# EAGLE schematic VentaConnected_Arduino_V0.01_2017-11-21_AutoRouting (EAGLE 8.3.2)
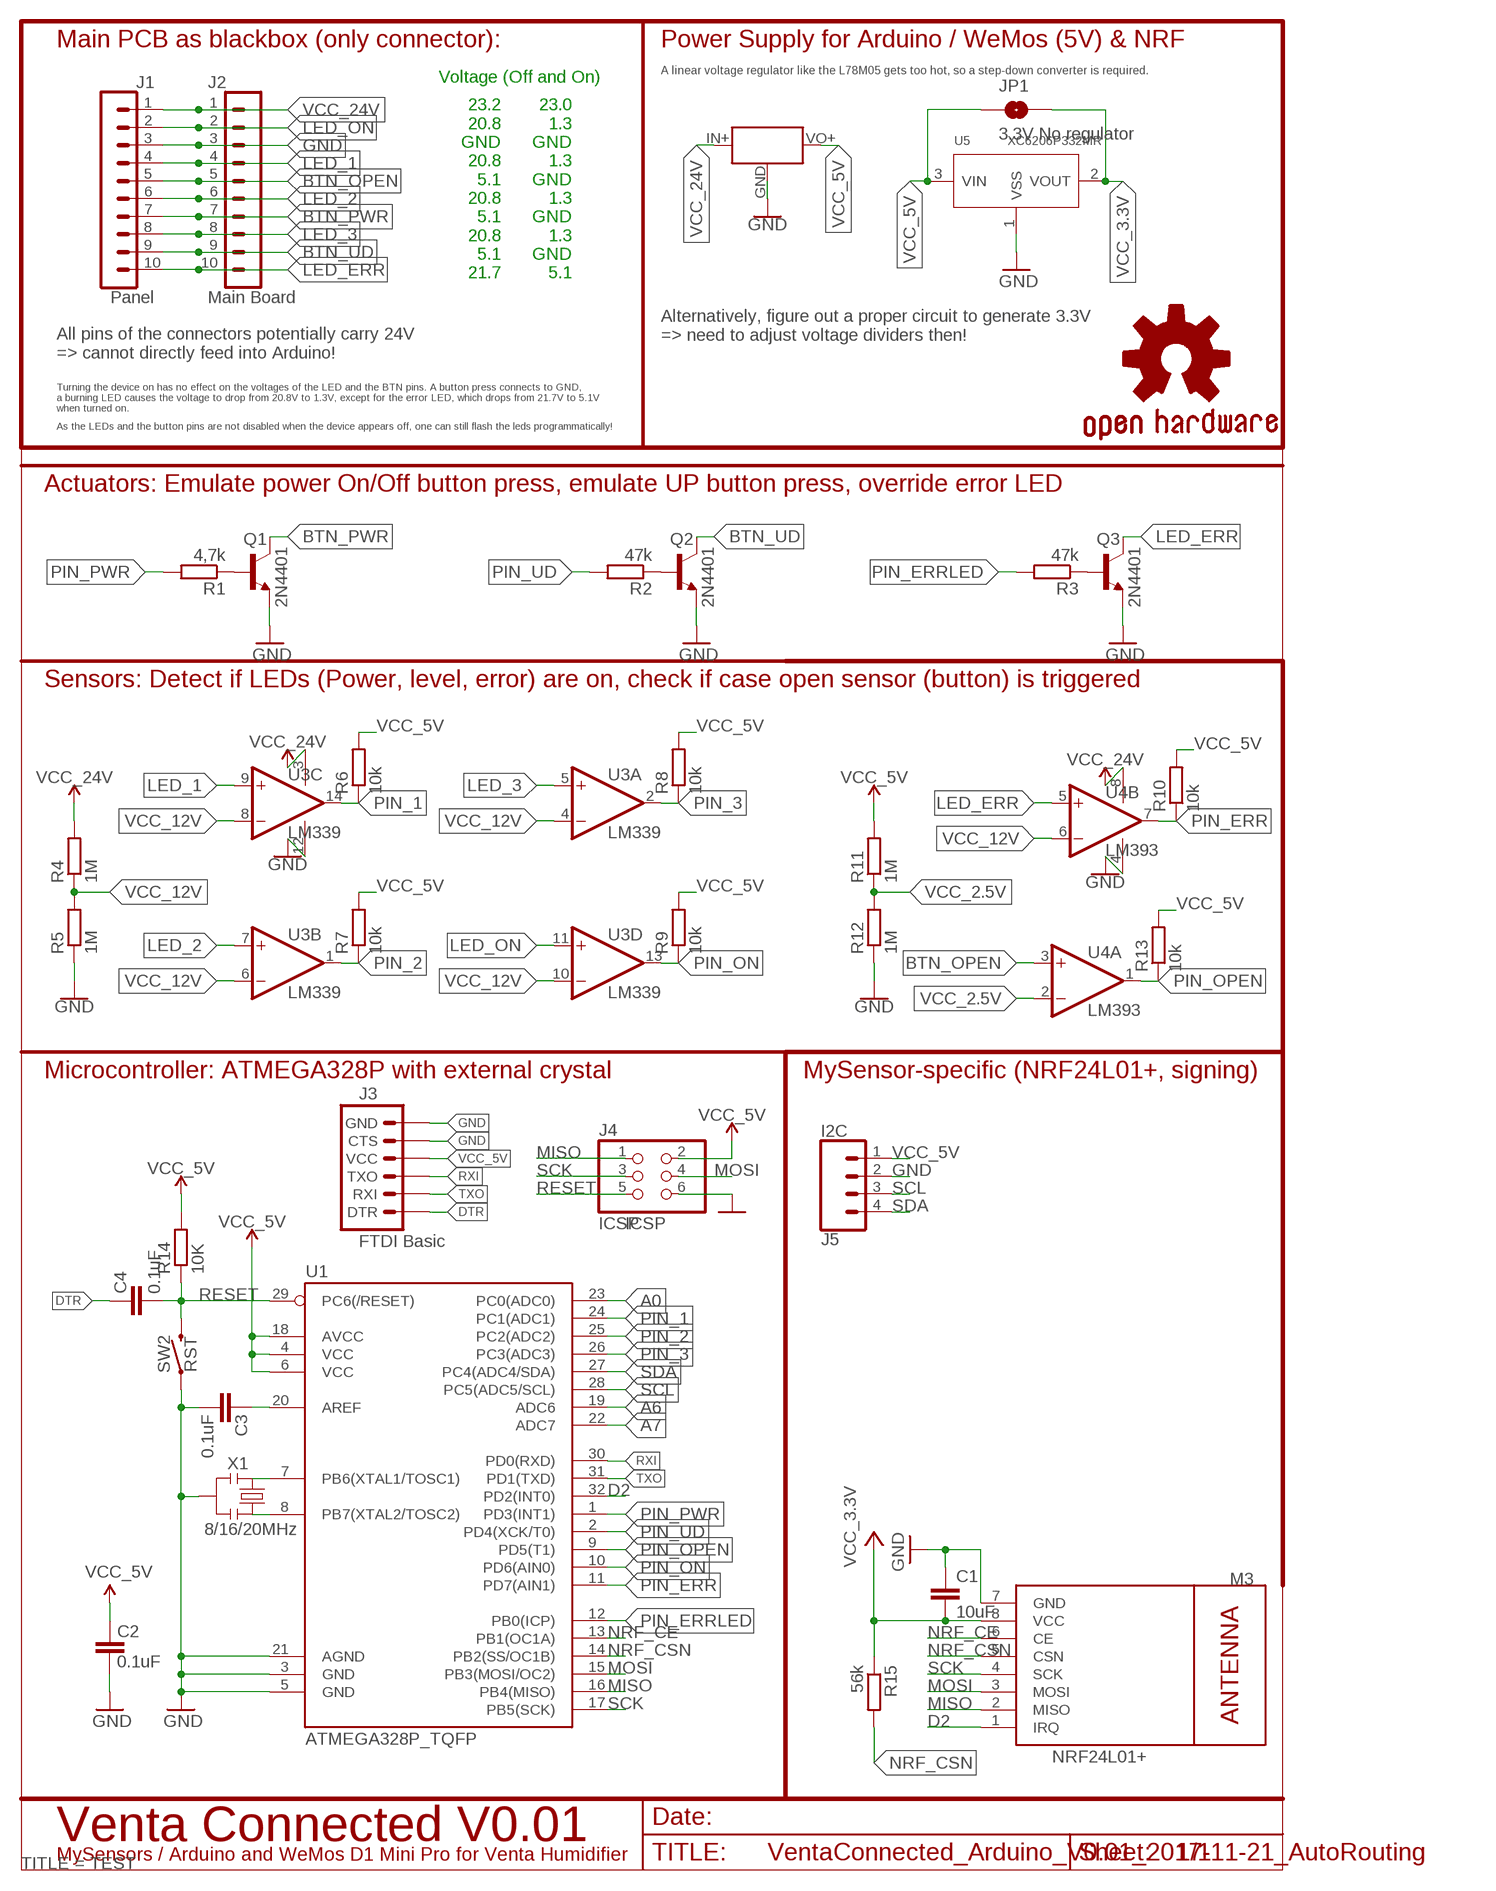
[diagram p0: schematic, sheet 1]
FRAME3 (A4-SMALL-DOCFIELD): TITLE: TEST

## Parts
C1  10uF  C-EUC0805  [C0805]
C2  0.1uF  CAP0805  [0805]
C3  0.1uF  CAP0805  [0805]
C4  0.1uF  CAP0805  [0805]
GOLD_ORB_SM1  OSHWLOGO_GOLD_ORB_SM  [OSHW2]
J1  Panel  CONN_05X2SHD  [2X5-SHROUDED]
J2  Main Board  CONN_05X2PTH  [2X5]
J3  FTDI Basic  ARDUINO_SERIAL_PROGRAMPTH  [1X06]
J4  ICSP  PINHD-2X3  [2X03]
J5  I2C  CONN_04  [1X04]
JP1  3.3V No regulator  JUMPER-SMT_2_NO_SILK  [SMT-JUMPER_2_NO_SILK]
M3  NRF24L01+  WIRELESS-NRF24L01SMD  [WIRELESS-NRF24L01-SMD]
Q1  2N4401  MMBT4401LT1-NPN-SOT23-BEC  [SOT23-BEC]
Q2  2N4401  MMBT4401LT1-NPN-SOT23-BEC  [SOT23-BEC]
Q3  2N4401  MMBT4401LT1-NPN-SOT23-BEC  [SOT23-BEC]
R1  4,7k  R-EU_R0805  [R0805]
R2  47k  R-EU_R0805  [R0805]
R3  47k  R-EU_R0805  [R0805]
R4  1M  R-EU_R0805  [R0805]
R5  1M  R-EU_R0805  [R0805]
R6  10k  R-EU_R0805  [R0805]
R7  10k  R-EU_R0805  [R0805]
R8  10k  R-EU_R0805  [R0805]
R9  10k  R-EU_R0805  [R0805]
R10  10k  R-EU_R0805  [R0805]
R11  1M  R-EU_R0805  [R0805]
R12  1M  R-EU_R0805  [R0805]
R13  10k  R-EU_R0805  [R0805]
R14  10K  R-EU_R0805  [R0805]
R15  56k  R-EU_R0805  [R0805]
SW2  RST  MOMENTARY-SWITCH-SPST-SMD-6.0X3.5MM  [TACTILE_SWITCH_SMD_6.0X3.5MM]
U1  ATMEGA328P_TQFP  [TQFP32-08]
U2  MINI_BUCK_CONVERTER_UPSIDEDOWN  [MINI_BUCK_CONVERTER_UPDOWN]
U3  LM339  TLC339D  [SO14]
U4  LM393  LM393D  [SO08]
U5  XC6206P332MR  PMIC-LDO-XC6206P332MR-G(SOT23)  [SOT-23]
X1  8/16/20MHz  RESONATOR1:1  [RESONATOR-SMD-1:1]

## Nets
A0: U1.23(PC0(ADC0))
A6: U1.19(ADC6)
A7: U1.22(ADC7)
AREF: C3.2 U1.20(AREF)
BTN_OPEN: J1.5 J2.5 U4.3(A:+IN)
BTN_PWR: J1.7 J2.7 Q1.C
BTN_UD: J1.9 J2.9 Q2.C
D2: M3.1(IRQ) U1.32(PD2(INT0))
DTR: C4.2 J3.1(DTR)
GND: C1.1 C2.1 C3.1 J1.3 J2.3 J3.5(CTS) J3.6(GND) J4.6 J5.2 M3.7(GND) Q1.E Q2.E Q3.E R5.1 R12.1 SW2.1 U1.3(GND) U1.5(GND) U1.21(AGND) U2.GND U3.12(P:V-) U4.4(P:V-) U5.1(VSS) X1.2
LED_1: J1.4 J2.4 U3.9(C:+IN)
LED_2: J1.6 J2.6 U3.7(B:+IN)
LED_3: J1.8 J2.8 U3.5(A:+IN)
LED_ERR: J1.10 J2.10 Q3.C U4.5(B:+IN)
LED_ON: J1.2 J2.2 U3.11(D:+IN)
MISO: J4.1 M3.2(MISO) U1.16(PB4(MISO))
MOSI: J4.4 M3.3(MOSI) U1.15(PB3(MOSI/OC2))
N$2: Q1.B R1.1
N$5: Q3.B R3.1
N$6: Q2.B R2.1
N$12: U1.8(PB7(XTAL2/TOSC2)) X1.3
N$13: U1.7(PB6(XTAL1/TOSC1)) X1.1
NRF_CE: M3.6(CE) U1.13(PB1(OC1A))
NRF_CSN: M3.5(CSN) R15.2 U1.14(PB2(SS/OC1B))
PIN_1: R6.1 U1.24(PC1(ADC1)) U3.14(C:OUT)
PIN_2: R7.1 U1.25(PC2(ADC2)) U3.1(B:OUT)
PIN_3: R8.1 U1.26(PC3(ADC3)) U3.2(A:OUT)
PIN_ERR: R10.1 U1.11(PD7(AIN1)) U4.7(B:OUT)
PIN_ERRLED: R3.2 U1.12(PB0(ICP))
PIN_ON: R9.1 U1.10(PD6(AIN0)) U3.13(D:OUT)
PIN_OPEN: R13.1 U1.9(PD5(T1)) U4.1(A:OUT)
PIN_PWR: R1.2 U1.1(PD3(INT1))
PIN_UD: R2.2 U1.2(PD4(XCK/T0))
RESET: C4.1 J4.5 R14.1 SW2.2 U1.29(PC6(/RESET))
RXI: J3.3(TXO) U1.30(PD0(RXD))
SCK: J4.3 M3.4(SCK) U1.17(PB5(SCK))
SCL: J5.3 U1.28(PC5(ADC5/SCL))
SDA: J5.4 U1.27(PC4(ADC4/SDA))
TXO: J3.2(RXI) U1.31(PD1(TXD))
VCC_2.5V: R11.1 R12.2 U4.2(A:-IN)
VCC_3.3V: C1.2 JP1.2 M3.8(VCC) R15.1 U5.2(VOUT)
VCC_5V: C2.2 J3.4(VCC) J4.2 J5.1 JP1.1 R6.2 R7.2 R8.2 R9.2 R10.2 R11.2 R13.2 R14.2 U1.4(VCC) U1.6(VCC) U1.18(AVCC) U2.VO+(VOUT) U5.3(VIN)
VCC_12V: R4.1 R5.2 U3.4(A:-IN) U3.6(B:-IN) U3.8(C:-IN) U3.10(D:-IN) U4.6(B:-IN)
VCC_24V: J1.1 J2.1 R4.2 U2.IN+(VIN) U3.3(P:V+) U4.8(P:V+)

## Notes on the sheet
- Main PCB as blackbox (only connector): | Power Supply for Arduino / WeMos (5V) & NRF
- A linear voltage regulator like the L78M05 gets too hot, so a step-down converter is required.
- Voltage (Off and On)
- 23.2
  20.8
  GND
  20.8
  5.1
  20.8
  5.1
  20.8
  5.1
  21.7
- 23.0
  1.3
  GND
  1.3
  GND
  1.3
  GND
  1.3
  GND
  5.1
- Alternatively, figure out a proper circuit to generate 3.3V 
  => need to adjust voltage dividers then!
- All pins of the connectors potentially carry 24V 
  => cannot directly feed into Arduino!
- Turning the device on has no effect on the voltages of the LED and the BTN pins. A button press connects to GND, 
  a burning LED causes the voltage to drop from 20.8V to 1.3V, except for the error LED, which drops from 21.7V to 5.1V 
  when turned on.
- As the LEDs and the button pins are not disabled when the device appears off, one can still flash the leds programmatically!
- Actuators: Emulate power On/Off button press, emulate UP button press, override error LED
- Sensors: Detect if LEDs (Power, level, error) are on, check if case open sensor (button) is triggered
- Microcontroller: ATMEGA328P with external crystal | MySensor-specific (NRF24L01+, signing)
- ICSP
- Venta Connected V0.01
- MySensors / Arduino and WeMos D1 Mini Pro for Venta Humidifier

## Library data of the parts
C1 = rcl:C-EU: CAPACITOR, European symbol
C2-C4 = SparkFun:CAP: Capacitor Standard 0603 ceramic capacitor, and 0.1" leaded capacitor.
GOLD_ORB_SM1 = bfl:OSHWLOGO: These are Open-Source Hardware logos.
J1 = opentools-connectors:CONN_05X2: Multi connection point. Often used as Generic Header-pin footprint for 0.1 inch spaced/style header connections For AVR SPI programming port, see special device with nice symbol: "AVR_SPI_PROG_5x2.dev" You can populate with any combo of single row headers, but if you'd like an exact match, check these: 2x5 AVR ICSP Male Header <https://www.sparkfun.com/products/778> (PRT-00778) 2x5 Pin Shrouded Header <https://www.sparkfun.com/products/8506> (PRT-08506) On any of the 0.1 inch spaced packages, you can populate with these: Break Away Headers - Straight <https://www.sparkfun.com/products/116> (PRT-00116) Break Away Male Headers - Right Angle <https://www.sparkfun.com/products/553> (PRT-00553) Female Headers <https://www.sparkfun.com/products/115> (PRT-00115) Break Away Headers - Machine Pin <https://www.sparkfun.com/products/117> (PRT-00117) Break Away Female Headers - Swiss Machine Pin <https://www.sparkfun.com/products/743> (PRT-00743) Special note: the shrouded connector mates well with our 5x2 ribbon cables: 2x5 Pin IDC Ribbon Cable <https://www.sparkfun.com/products/8535> (PRT-08535); PROD_ID: CONN-08671; SF_ID: PRT-08506
J2 = opentools-connectors:CONN_05X2: Multi connection point. Often used as Generic Header-pin footprint for 0.1 inch spaced/style header connections For AVR SPI programming port, see special device with nice symbol: "AVR_SPI_PROG_5x2.dev" You can populate with any combo of single row headers, but if you'd like an exact match, check these: 2x5 AVR ICSP Male Header <https://www.sparkfun.com/products/778> (PRT-00778) 2x5 Pin Shrouded Header <https://www.sparkfun.com/products/8506> (PRT-08506) On any of the 0.1 inch spaced packages, you can populate with these: Break Away Headers - Straight <https://www.sparkfun.com/products/116> (PRT-00116) Break Away Male Headers - Right Angle <https://www.sparkfun.com/products/553> (PRT-00553) Female Headers <https://www.sparkfun.com/products/115> (PRT-00115) Break Away Headers - Machine Pin <https://www.sparkfun.com/products/117> (PRT-00117) Break Away Female Headers - Swiss Machine Pin <https://www.sparkfun.com/products/743> (PRT-00743) Special note: the shrouded connector mates well with our 5x2 ribbon cables: 2x5 Pin IDC Ribbon Cable <https://www.sparkfun.com/products/8535> (PRT-08535); PROD_ID: CONN-08499; SF_ID: PRT-0778
J3 = SparkFun:ARDUINO_SERIAL_PROGRAM
J4 = analyzer:PINHD-2X3
J5 = SparkFun-Connectors:CONN_04: Multi connection point. Often used as Generic Header-pin footprint for 0.1 inch spaced/style header connections On any of the 0.1 inch spaced packages, you can populate with these: Break Away Headers - Straight <https://www.sparkfun.com/products/116> (PRT-00116) Break Away Male Headers - Right Angle <https://www.sparkfun.com/products/553> (PRT-00553) Female Headers <https://www.sparkfun.com/products/115> (PRT-00115) Break Away Headers - Machine Pin <https://www.sparkfun.com/products/117> (PRT-00117) Break Away Female Headers - Swiss Machine Pin <https://www.sparkfun.com/products/743> (PRT-00743) For SCREWTERMINALS and SPRING TERMINALS visit here: Screw Terimnals on SparkFun.com <https://www.sparkfun.com/search/results?term=Screw+Terminals> (5mm/3.5mm/2.54mm spacing) This device is also useful as a general connection point to wire up your design to another part of your project. Our various solder wires solder well into these plated through hole pads. Hook-Up Wire - Assortment (Stranded, 22 AWG) <https://www.sparkfun.com/products/11375> (PRT-11375) Hook-Up Wire - Assortment (Solid Core, 22 AWG) <https://www.sparkfun.com/products/11367> (PRT-11367) View the entire wire category on our website here <https://www.sparkfun.com/categories/141> Special notes: Molex polarized connector foot print use with SKU : PRT-08231 with associated crimp pins and housings. 1MM SMD Version SKU: PRT-10208; PROD_ID: CONN-09696
JP1 = SparkFun-Jumpers:JUMPER-SMT_2_NO: Normally open jumper This jumper has two pads in close proximity to each other. Apply solder to close the connection. Round pads are easier to solder for beginners, but are a lot larger. SparkFun Product that uses the round pads: SparkFun EL Sequencer <https://www.sparkfun.com/products/12781>
M3 = nrf24l01plus:WIRELESS-NRF24L01: 2.4 GHz Wireless Module based on NRF24L01 chip
Q1-Q3 = transistor-neu-to92:*-NPN-: NPN Transistror
R1-R5 R11 R12 = resistor:R-EU_: RESISTOR, European symbol
R6-R10 R13-R15 = rcl:R-EU_: RESISTOR, European symbol
SW2 = SparkFun-Switches:MOMENTARY-SWITCH-SPST: Momentary Switch (Pushbutton) - SPST Normally-open (NO) SPST momentary switches (buttons, pushbuttons). Variants PTH-12MM - 12mm square, through-hole Momentary Pushbutton Switch - 12mm Square <https://www.sparkfun.com/products/9190> (COM-09190) PTH-6.0MM, PTH-6.0MM-KIT - 6.0mm square, through-hole Mini Pushbutton Switch <https://www.sparkfun.com/products/97> (COM-00097) KIT package intended for soldering kit's - only one side of pads' copper is exposed. PTH-RIGHT-ANGLE-KIT - Right-angle, through-hole Right Angle Tactile Button <https://www.sparkfun.com/products/10791> - Used on SparkFun BigTime Watch Kit <https://www.sparkfun.com/products/11734> SMD-12MM - 12mm square, surface-mount Tactile Button - SMD (12mm) <https://www.sparkfun.com/products/12993> (COM-12993) Used on SparkFun PicoBoard <https://www.sparkfun.com/products/11888> SMD-4.5MM - 4.5mm Square Trackball Switch Used on SparkFun Blackberry Trackballer Breakout <https://www.sparkfun.com/products/13169> SMD-4.6MMX2.8MM - 4.60mm x 2.80mm, surface mount Used on SparkFun SAMD21 Mini Breakout <https://www.sparkfun.com/products/13664> SMD-5.2MM, SMD-5.2-REDUNDANT - 5.2mm square, surface-mount Mini Pushbutton Switch - SMD <https://www.sparkfun.com/products/8720> (COM-08720) Used on Arduino Pro Mini <https://www.sparkfun.com/products/11114> REDUNDANT package connects both switch circuits together SMD-6.0X3.5MM - 6.0 x 3.5mm, surface mount Momentary Reset Switch SMD <https://www.sparkfun.com/products/8229> (COM-08229) SMD-6.2MM-TALL - 6.2mm square, surface mount Tactile Button - SMD (6mm) <https://www.sparkfun.com/products/12992> Used on SparkFun Digital Sandbox <https://www.sparkfun.com/products/12651> SMD-RIGHT-ANGLE - Right-angle, surface mount Used on SparkFun Block for Intel® Edison - Arduino <https://www.sparkfun.com/products/13036>; PROD_ID: SWCH-00815; SF_SKU: COM-08229
U1 = SparkFun-IC-Microcontroller:ATMEGA328P_TQFP: Popular 328P in QFP Storefront component: ATmega328 - TQFP <https://www.sparkfun.com/products/13448> (COM-13448) Datasheet <http://www.sparkfun.com/datasheets/Components/SMD/ATMega328.pdf> SparkFun Products SparkFun RedBoard - Programmed with Arduino <https://www.sparkfun.com/products/12757> (DEV-12757) Arduino Pro Mini 328 - 5V/16MHz <https://www.sparkfun.com/products/11113> (DEV-11113) Arduino Pro Mini 328 - 3.3V/8MHz <https://www.sparkfun.com/products/11114> (DEV-11114) SparkFun OpenLog <https://www.sparkfun.com/products/13712> (DEV-13712) SparkFun MicroView - OLED Arduino Module <https://www.sparkfun.com/products/12923> (DEV-12923) SparkFun Digital Sandbox <https://www.sparkfun.com/products/12651> (DEV-12651) SparkFun PicoBoard <https://www.sparkfun.com/products/11888> (WIG-11888) Arduino Fio <https://www.sparkfun.com/products/10116> (DEV-10116) LilyPad Arduino 328 Main Board <https://www.sparkfun.com/products/13342> (DEV-13342) SparkFun RedStick <https://www.sparkfun.com/products/13741> (DEV-13741) LilyPad MP3 <https://www.sparkfun.com/products/11013> (DEV-11013) LilyPad Arduino SimpleSnap <https://www.sparkfun.com/products/10941> (DEV-10941) SparkFun Stepoko <https://www.sparkfun.com/products/13899> (ROB-13899) SparkFun Geiger Counter <https://www.sparkfun.com/products/11345> (SEN-11345) SparkFun EL Sequencer <https://www.sparkfun.com/products/12781> (COM-12781) Arduino Pro 328 - 5V/16MHz <https://www.sparkfun.com/products/10915> (DEV-10915) CryptoCape <https://www.sparkfun.com/products/12773> (DEV-12773) SparkFun IR Thermometer Evaluation Board - MLX90614 <https://www.sparkfun.com/products/10740> (SEN-10740) SparkFun RedBot Mainboard <https://www.sparkfun.com/products/12097> (ROB-12097) Arduino Pro 328 - 3.3V/8MHz <https://www.sparkfun.com/products/10914> (DEV-10914) SparkFun Block for Intel® Edison - Arduino <https://www.sparkfun.com/products/13036> (DEV-13036) SparkFun Simon Says - Surface Mount Soldering Kit <https://www.sparkfun.com/products/10935> (KIT-10935) SparkFun 7-Segment Serial Display - Red <https://www.sparkfun.com/products/11441> (COM-11441) SparkFun 7-Segment Serial Display - White <https://www.sparkfun.com/products/11629> (COM-11629) SparkFun 7-Segment Serial Display - Yellow <https://www.sparkfun.com/products/11443> (COM-11443) SparkFun 7-Segment Serial Display - Kelly Green <https://www.sparkfun.com/products/11440> (COM-11440) SparkFun 7-Segment Serial Display - Blue <https://www.sparkfun.com/products/11442> (COM-11442) SparkFun OpenSegment Serial Display - 20mm (Blue) <https://www.sparkfun.com/products/11647> (COM-11647) SparkFun OpenSegment Serial Display - 20mm (Green) <https://www.sparkfun.com/products/11646> (COM-11646) SparkFun OpenSegment Serial Display - 20mm (White) <https://www.sparkfun.com/products/11648> (COM-11648) SparkFun OpenSegment Serial Display - 20mm (Red) <https://www.sparkfun.com/products/11644> (COM-11644) SparkFun OpenSegment Serial Display - 20mm (Yellow) <https://www.sparkfun.com/products/11645> (COM-11645) SparkFun OpenSegment Shield <https://www.sparkfun.com/products/13190> (DEV-13190); PROD_ID: IC-09069
U2 = opentools-sensors:MINI_BUCK_CONVERTER: 4.5-40V Step Down Buck Converter
U3 = linear:TLC339: COMPARATOR
U4 = linear:LM393: COMPARATOR
U5 = Seeed-IC:PMIC-LDO-XC6206P332MR-G(SOT23): 310030099; MPN: XC6206P332MR-G; VALUE: XC6206P332MR-G-SOT23
X1 = Testing:RESONATOR: Resonator Small SMD resonator. This is the itty bitty 10/20MHz resonators with built in caps. CSTCE10M0G55 and CSTCE20M0V53. Footprint for SMD has been used in SFE production for years, and does work okay. 1:1 is an attempt to get larger fillets on the sides so it will be easier to inspect these solders in our AOI machine. The pads have been minimized to match the actual metal under the resonator. To see this relation, it includes an image import of the bottom side of the component. Imported to scale on layer 200.

## Net classes
0 default: width 0.203 mm
1 vcc: width 0.254 mm